# Altium project UZ_CarrierBoard.PrjPcb (part 2 of 10)

## Sheet Rail_Protection_AD.SchDoc
size A4; SheetNumber: 40AD
Used 8 times, as channels U_Signal_Distribution/DIG1/U_RP-SlotD, U_Signal_Distribution/DIG2/U_RP-SlotD, U_Signal_Distribution/DIG3/U_RP-SlotD, U_Signal_Distribution/DIG4/U_RP-SlotD, U_Signal_Distribution/DIG5/U_RP-SlotD, U_Signal_Distribution/ANL1/U_RP-SlotA, U_Signal_Distribution/ANL2/U_RP-SlotA, U_Signal_Distribution/ANL3/U_RP-SlotA. Parts and nets are listed once, with the designators drawn on the sheet.
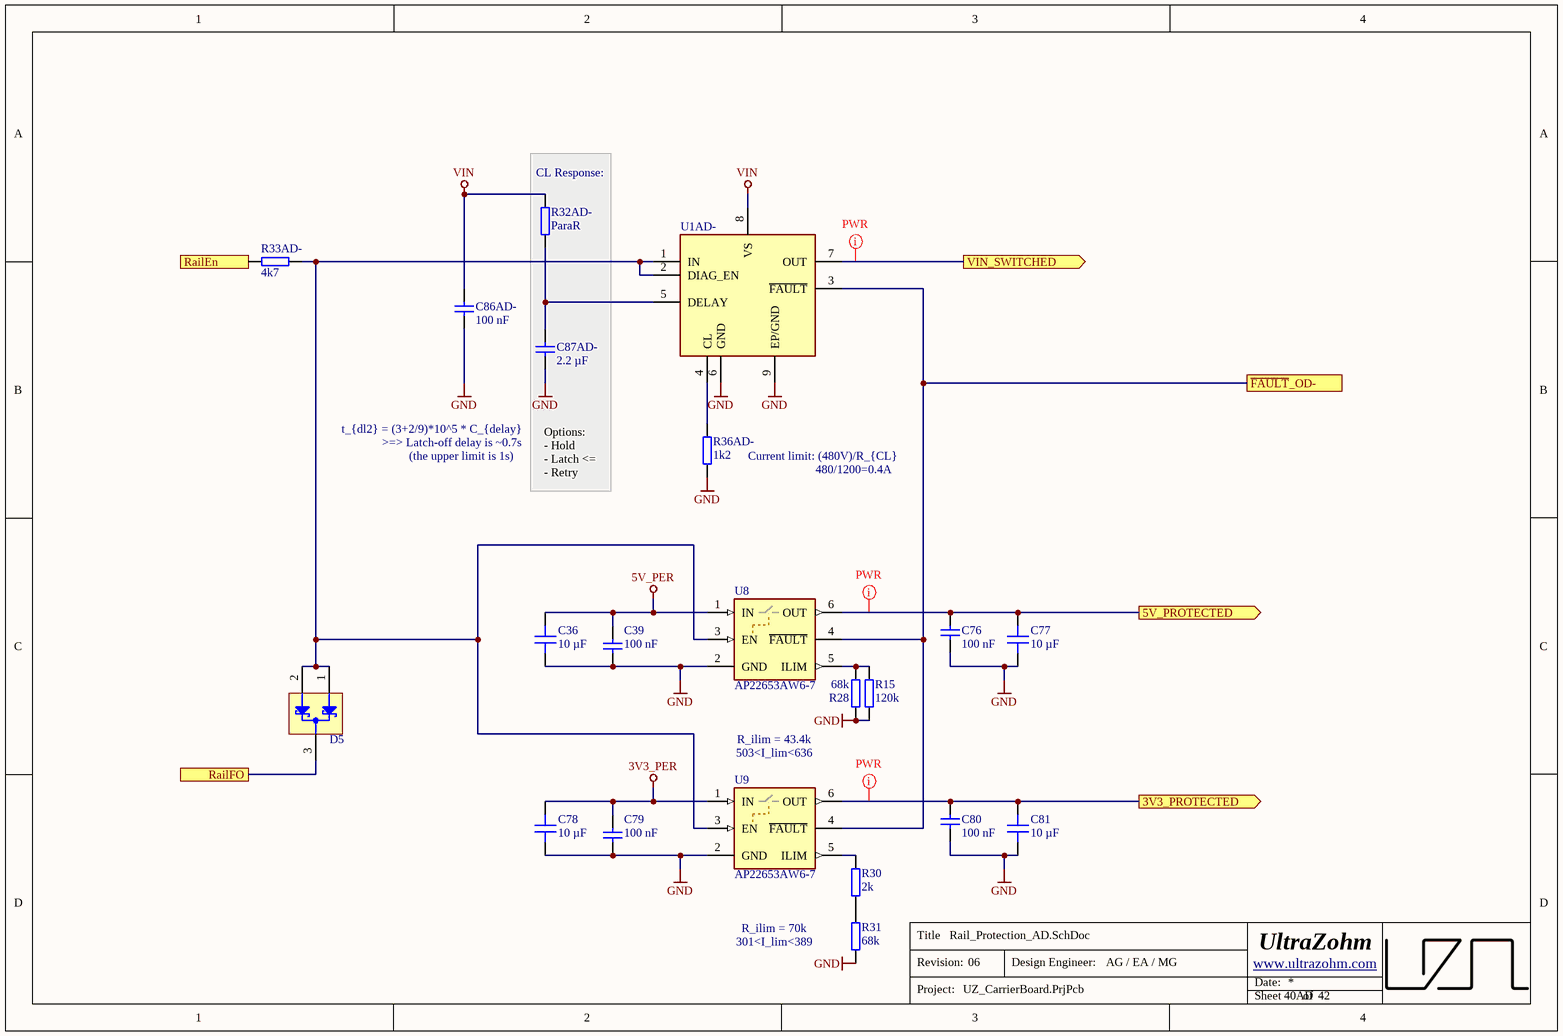
[diagram p3: Rail_Protection_AD.SchDoc]

### Parts
C36  10 µF  [C_0603_TE]
C39  100 nF  [C_0603_TE]
C76  100 nF  [C_0603_TE]
C77  10 µF  [C_0603_TE]
C78  10 µF  [C_0603_TE]
C79  100 nF  [C_0603_TE]
C80  100 nF  [C_0603_TE]
C81  10 µF  [C_0603_TE]
C86AD-  100 nF  [C_0603_TE]
C87AD-  2.2 µF  [C_0603_TE]
D5  BAT54CT-7-F  [SOT523-3]  (value not drawn)
R15  120k  [R_0603_TE]
R28  68k  [R_0603_TE]
R30  2k  [R_0603_TE]
R31  68k  [R_0603_TE]
R32AD-  ParaR  [R_0603_TE]
R33AD-  4k7  [R_0603_TE]
R36AD-  1k2  [R_0603_TE]
U1AD-  TPS1H000AQDGNRQ1  [SOP65P490X110-9N]  (value not drawn)
U8  AP22653AW6-7  [TSOT26-6]
U9  AP22653AW6-7  [TSOT26-6]

### Blocks framed on the sheet
CL Response:: C87AD- R32AD-

### Ports
3V3_PROTECTED (out), 5V_PROTECTED (out), RailEn (in), RailFO, VIN_SWITCHED (out), ~{FAULT}_OD-

### Nets
3V3_PER: C78.2 C79.1 U9.1(IN)
5V_PER: C36.2 C39.1 U8.1(IN)
GND: C36.1 C39.2 C76.2 C77.1 C78.1 C79.2 C80.2 C81.1 C86AD-.1 C87AD-.1 R15.2 R28.2 R31.2 R36AD-.1 U1AD-.6(GND) U1AD-.9(EP/GND) U8.2(GND) U9.2(GND)
VIN: C86AD-.2 R32AD-.2 U1AD-.8(VS)
3V3_PROTECTED: C80.1 C81.2 U9.6(OUT) ; port 3V3_PROTECTED
5V_PROTECTED: C76.1 C77.2 U8.6(OUT) ; port 5V_PROTECTED
~{FAULT}_OD-: U1AD-.3(~{FAULT}) U8.4(~{FAULT}) U9.4(~{FAULT}) ; port ~{FAULT}_OD-
RailEn: R33AD-.1 ; port RailEn
RailFO: D5.3(K) ; port RailFO
VIN_SWITCHED: U1AD-.7(OUT) ; port VIN_SWITCHED
NetC87AD-_2: C87AD-.2 R32AD-.1 U1AD-.5(DELAY)
NetD5_1: D5.1(A) D5.2(A) R33AD-.2 U1AD-.1(IN) U1AD-.2(DIAG_EN) U8.3(EN) U9.3(EN)
NetR15_1: R15.1 R28.1 U8.5(ILIM)
NetR30_1: R30.1 U9.5(ILIM)
NetR30_2: R30.2 R31.1
NetR36AD-_2: R36AD-.2 U1AD-.4(CL)

### Channels
U_Signal_Distribution/DIG1/U_RP-SlotD: designators end in A; ports 3V3_PROTECTED=3V3_PROTECTED_DSLOT-_DIG1 5V_PROTECTED=5V_PROTECTED_DSLOT-_DIG1 RailEn=RailEn RailFO=RailFO_D1 VIN_SWITCHED=VIN_SWITCHED_DSLOT-_DIG1 ~{FAULT}_OD-=~{FAULT}_OD_DSLOT-_DIG1
U_Signal_Distribution/DIG2/U_RP-SlotD: designators end in B; ports 3V3_PROTECTED=3V3_PROTECTED_DSLOT-_DIG2 5V_PROTECTED=5V_PROTECTED_DSLOT-_DIG2 RailEn=RailEn RailFO=RailFO_D2 VIN_SWITCHED=VIN_SWITCHED_DSLOT-_DIG2 ~{FAULT}_OD-=~{FAULT}_OD_DSLOT-_DIG2
U_Signal_Distribution/DIG3/U_RP-SlotD: designators end in C; ports 3V3_PROTECTED=3V3_PROTECTED_DSLOT-_DIG3 5V_PROTECTED=5V_PROTECTED_DSLOT-_DIG3 RailEn=RailEn RailFO=RailFO_D3 VIN_SWITCHED=VIN_SWITCHED_DSLOT-_DIG3 ~{FAULT}_OD-=~{FAULT}_OD_DSLOT-_DIG3
U_Signal_Distribution/DIG4/U_RP-SlotD: designators end in D; ports 3V3_PROTECTED=3V3_PROTECTED_DSLOT-_DIG4 5V_PROTECTED=5V_PROTECTED_DSLOT-_DIG4 RailEn=RailEn RailFO=RailFO_D4 VIN_SWITCHED=VIN_SWITCHED_DSLOT-_DIG4 ~{FAULT}_OD-=~{FAULT}_OD_DSLOT-_DIG4
U_Signal_Distribution/DIG5/U_RP-SlotD: designators end in E; ports 3V3_PROTECTED=3V3_PROTECTED_DSLOT-_DIG5 5V_PROTECTED=5V_PROTECTED_DSLOT-_DIG5 RailEn=RailEn RailFO=RailFO_D5 VIN_SWITCHED=VIN_SWITCHED_DSLOT-_DIG5 ~{FAULT}_OD-=~{FAULT}_OD_DSLOT-_DIG5
U_Signal_Distribution/ANL1/U_RP-SlotA: designators end in F; ports 3V3_PROTECTED=3V3_PROTECTED_ASLOT-_ANL1 5V_PROTECTED=5V_PROTECTED_ASLOT-_ANL1 RailEn=RailEn RailFO=RailFO_A1 VIN_SWITCHED=VIN_SWITCHED_ASLOT-_ANL1 ~{FAULT}_OD-=~{FAULT}_OD-
U_Signal_Distribution/ANL2/U_RP-SlotA: designators end in G; ports 3V3_PROTECTED=3V3_PROTECTED_ASLOT-_ANL2 5V_PROTECTED=5V_PROTECTED_ASLOT-_ANL2 RailEn=RailEn RailFO=RailFO_A2 VIN_SWITCHED=VIN_SWITCHED_ASLOT-_ANL2 ~{FAULT}_OD-=~{FAULT}_OD-
U_Signal_Distribution/ANL3/U_RP-SlotA: designators end in H; ports 3V3_PROTECTED=3V3_PROTECTED_ASLOT-_ANL3 5V_PROTECTED=5V_PROTECTED_ASLOT-_ANL3 RailEn=RailEn RailFO=RailFO_A3 VIN_SWITCHED=VIN_SWITCHED_ASLOT-_ANL3 ~{FAULT}_OD-=~{FAULT}_OD-

### Layout directives
net class PWR: 3V3_PROTECTED_DSLOT-_DIG1, 5V_PROTECTED_DSLOT-_DIG1, VIN_SWITCHED_DSLOT-_DIG1

### Notes on the sheet
- t_{dl2} = (3+2/9)*10^5 * C_{delay}
- >=> Latch-off delay is ~0.7s
- (the upper limit is 1s)
- Options:
  - Hold
  - Latch <=
  - Retry
- (near R36AD-) Current limit: (480V)/R_{CL}
- 480/1200=0.4A
- R_ilim = 43.4k
- 503<I_lim<636
- R_ilim = 70k
- 301<I_lim<389
- Title
- Revision:
- Design Engineer:
- Date:
- Project:
- Sheet
- of

### Library data of the parts
C36 C77 C78 C81 = CL10A106MO8NQNC: Capacitor 0603, 16 VDC, 10 µF, X5R; Manufacturer: Samsung Electro-Mechanics; Tolerance: 20 %; Voltage Rating: 16 VDC; Created from: AGeiger; Manufacturer Part Number: CL10A106MO8NQNC; PartID: 101; Created On: 22/08/2022 13:56:44; ComponentLink1Description: Datasheet; ComponentLink1URL: https://datasheet.lcsc.com/lcsc/1810261909_Samsung-Electro-Mechanics-CL10A106MO8NQNC_C92487.pdf; Component Type: Capacitor 0603; Device Package: 0603; Last Updated: 19/11/2024 12:40:46; Mounting Type: SMD; Operating Temperature: -55 - 85°C; Series: X5R; Supplier 1: LCSC; Supplier Part Number 1: C92487; Type: Capacitor; Value: 10 µF; Live Cycle Status: 1; LCSC Part Number: C92487
C39 C76 C79 C80 C86AD- = UZgen_C_0603_100nF_50V_X7R: Generic capacitor; Manufacturer: UZgen; Voltage: 50V; Tolerance: 10 %; Created from: AGeiger; Manufacturer Part Number: UZgen_C_0603_100nF_50V_X7R; PartID: 1; Created On: 02/07/2024 14:42:23; Value: 100 nF; Device Package: 0603; Technology: X7R; Mounting Type: SMD; Last Updated: 08/08/2024 15:01:15
C87AD- = UZgen_C_0603_2.2uF_50V_X7R: Generic capacitor; Manufacturer: UZgen; Voltage: 50V; Tolerance: 10 %; Created from: UZgenTool; Manufacturer Part Number: UZgen_C_0603_2.2uF_50V_X7R; PartID: 4317; Created On: 02/08/2024 11:18:10; Value: 2.2 µF; Device Package: 0603; Technology: X7R; Mounting Type: SMD; Last Updated: 02/08/2024 11:18:10
D5 = BAT54CT-7-F: Surface-mount Schottky Barrier Diode, 1 Pair Common Cathode 1V@100mA 200mA 2uA@25V 30V SOT-523-3; Manufacturer: Diodes Incorporated; Type: Schottky Diode; Forward Current: 1 mA; Forward Voltage: 320 mV; Reverse Current: 2 µA; Created from: MGeier; Manufacturer Part Number: BAT54CT-7-F; PartID: 28; Created On: 19/07/2025 15:30:00; ComponentLink1Description: Datasheet; ComponentLink1URL: https://www.diodes.com/datasheet/download/BAT54T.pdf; Component Type: Schottky Diode; Device Package: SOT-523-3; Last Updated: 21/07/2025 13:11:15; Mounting Type: SMD; Operating Temperature: -65 to +150 °C; Series: BAT54T/AT/CT/ST; Supplier 1: LCSC; Supplier Part Number 1: C134407; Value: 30 V; Live Cycle Status: 1; LCSC Part Number: C134407; Stock number: not stored; ComponentLink2Description: Homepage; ComponentLink2URL: https://www.diodes.com/part/view/BAT54CT
R15 = UZgen_R_0603_120k: Generic resistor; Manufacturer: UZgen; Tolerance: 1 %; Created from: UZgenTool; Manufacturer Part Number: UZgen_R_0603_120k; PartID: 270; Created On: 02/07/2024 17:29:50; Value: 120k; Device Package: 0603; Mounting Type: SMD; Last Updated: 02/07/2024 17:29:50
R28 R31 = UZgen_R_0603_68k: Generic resistor; Manufacturer: UZgen; Tolerance: 1 %; Created from: UZgenTool; Manufacturer Part Number: UZgen_R_0603_68k; PartID: 264; Created On: 02/07/2024 17:29:50; Value: 68k; Device Package: 0603; Mounting Type: SMD; Last Updated: 02/07/2024 17:29:50
R30 = UZgen_R_0603_2k: as R74 on sheet Signal_Distribution; Manufacturer Part Number: UZgen_R_0603_2k; PartID: 228; Created On: 02/07/2024 17:29:49; Value: 2k; Device Package: 0603; Mounting Type: SMD; Last Updated: 02/07/2024 17:29:49
R32AD- = UZgen_R_0603_ParaR: Generic resistor (parametric); Manufacturer: UZgen; Tolerance: 1 %; Created from: UZgenTool; Manufacturer Part Number: UZgen_R_0603_ParaR; PartID: 588; Created On: 08/07/2024 14:34:30; Value: ParaR; Device Package: 0603; Mounting Type: SMD; Last Updated: 08/07/2024 14:34:30
R33AD- = UZgen_R_0603_4k7: as R84 on sheet Signal_Distribution; Manufacturer Part Number: UZgen_R_0603_4k7; PartID: 237; Created On: 02/07/2024 17:29:50; Value: 4k7; Device Package: 0603; Mounting Type: SMD; Last Updated: 02/07/2024 17:29:50
R36AD- = UZgen_R_0603_1k2: Generic resistor; Manufacturer: UZgen; Tolerance: 1 %; Created from: UZgenTool; Manufacturer Part Number: UZgen_R_0603_1k2; PartID: 223; Created On: 02/07/2024 17:29:49; Value: 1k2; Device Package: 0603; Mounting Type: SMD; Last Updated: 02/07/2024 17:29:49
U1AD- = TPS1H000AQDGNRQ1: Power Switch ICs - Power Distribution 40-V, 1-ohm, 1-ch automotive smart high-side switch with adjustable current limit 8-HVSSOP -40 to 125; Manufacturer: Texas Instruments; Created from: FRosner; Manufacturer Part Number: TPS1H000AQDGNRQ1; PartID: 7; Created On: 15/07/2024 07:35:11; ComponentLink1Description: Datasheet; ComponentLink1URL: https://www.ti.com/lit/ds/symlink/tps1h000-q1.pdf; Component Type: Power Switch ICs; Device Package: MSOP-PowerPad-8; Last Updated: 11/04/2025 15:13:45; Mounting Type: SMD; Operating Temperature: -40 to +125 °C; Series: TPS1H000-Q1; Supplier 1: Mouser; Supplier Part Number 1: 595-TPS1H000AQDGNRQ1; Supplier 2: LCSC; Supplier Part Number 2: C2653764; Value: TPS1H000AQDGNRQ1; LCSC Part Number: C2653764
U8 U9 = AP22653AW6-7: Precision Adjustable Current-limited Power Switch; Manufacturer: Diodes Incorporated; Created from: MGeier; Manufacturer Part Number: AP22653AW6-7; PartID: 11; Created On: 10/04/2025 19:40:00; ComponentLink1Description: Datasheet; ComponentLink1URL: https://www.diodes.com/datasheet/download/AP22652_AP22653_AP22652A_AP22653A.pdf; ComponentLink2Description: Homepage; ComponentLink2URL: https://www.diodes.com/part/view/AP22653; Component Type: Power Switch ICs; Device Package: SOT26; Last Updated: 11/04/2025 15:13:45; Mounting Type: SMD; Operating Temperature: -40 to +125 °C; Series: AP22652/AP22653/AP22652A/AP22653A; Supplier 1: LCSC; Supplier Part Number 1: C1511768; Value: AP22653AW6-7; LCSC Part Number: C1511768